# EAGLE design usbtinyisp (EAGLE 7.7.0)
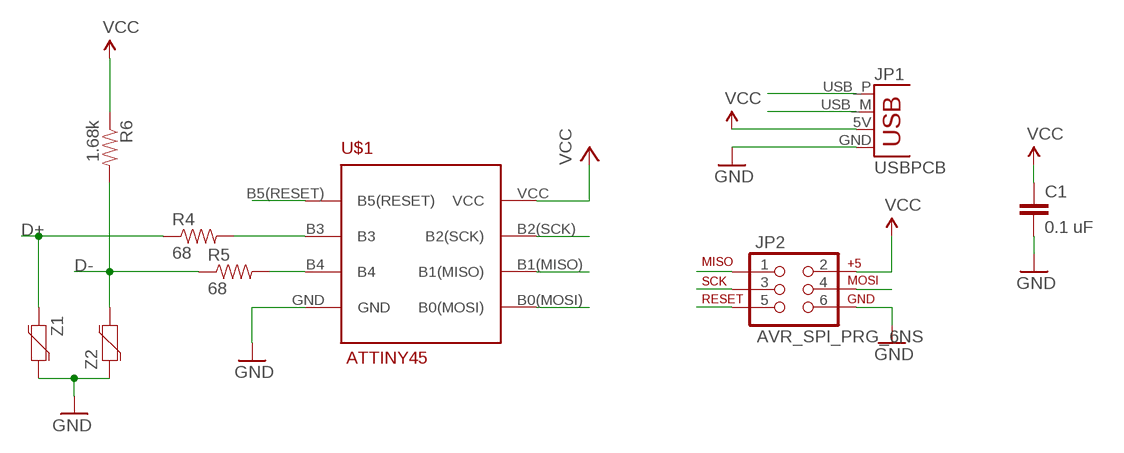
[diagram p0: schematic, sheet 1]

## Parts
C1  0.1 uF  CAP0603-CAP  [0603-CAP]
JP1  USBPCB  [USB-A-PCB]
JP2  AVR_SPI_PRG_6NS  [2X3-NS]
R4  68  RESISTOR0603-RES  [0603-RES]
R5  68  RESISTOR0603-RES  [0603-RES]
R6  1.68k  RESISTOR0603-RES  [0603-RES]
U$1  ATTINY45  [ATTINY45]
Z1  VARISTOR-0603  [0603-RES]
Z2  VARISTOR-0603  [0603-RES]

## Nets
D+: JP1.USB_P(D+) R4.1 Z1.1
D-: JP1.USB_M(D-) R5.1 R6.2 Z2.2
GND: C1.2 JP1.GND JP2.6 U$1.GND Z1.2 Z2.1
MISO: JP2.1 U$1.B1(MISO)
MOSI: JP2.4 U$1.B0(MOSI)
N$3: R4.2 U$1.B3
N$4: R5.2 U$1.B4
RST: JP2.5 U$1.B5(RESET)
SCK: JP2.3 U$1.B2(SCK)
VCC: C1.1 JP1.5V(VBUS) JP2.2 R6.1 U$1.VCC

## Library data of the parts
C1 = SparkFun-Capacitors:CAP: Capacitor Standard 0603 ceramic capacitor, and 0.1" leaded capacitor.
JP1 = SparkFun-Connectors:USB: USB Connectors USB-B-PTH is fully proven SKU : PRT-00139/CONN-08278 USB-miniB is fully proven SKU : PRT-00587 USB-A-PCB is untested. USB-A-H is throughly reviewed, but untested. Spark Fun Electronics SKU : PRT-00437 USB-B-SMT is throughly reviewed, but untested. Needs silkscreen touching up. USB-A-S has not been used/tested USB-MB-H has not been used/tested USB-MICROB has been used. CONN-09505
JP2 = SparkFun-Connectors:AVR_SPI_PRG_6: AVR ISP 6 Pin This is the reduced ISP connector for AVR programming. Common on Arduino. This footprint will take up less PCB space and can be used with a 10-pin to 6-pin adapter such as SKU: BOB-08508 **Special note about "TEST_POINT" package. The stop mask is on the top side, so if you want your programming test points to be on the bottom of your board, make sure to place this package on the bottom side of the board. This also ensure that the orientation to program from the bottom side will be correct.
R4-R6 = SparkFun-Passives:RESISTOR: Resistor Basic schematic elements and footprints for 0603, 1206, and PTH resistors.
U$1 = AVR_attinys:ATTINY45: http://www.atmel.com/images/atmel-2586-avr-8-bit-microcontroller-attiny25-attiny45-attiny85_datasheet.pdf
Z1 Z2 = SparkFun-DiscreteSemi:VARISTOR: Varistor Varistor (Variable resistor) is a nonlinear resistive element of the voltage dependence that resistance changes with applied voltage. Varistor is equivalent with Zener diode of two series connection.

## Board
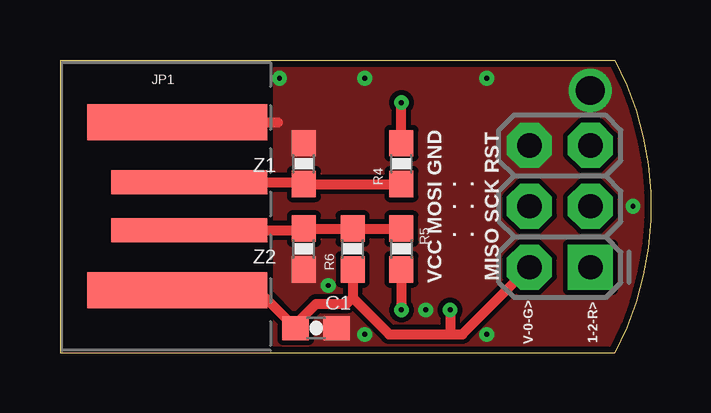
[diagram p1: board, top side]
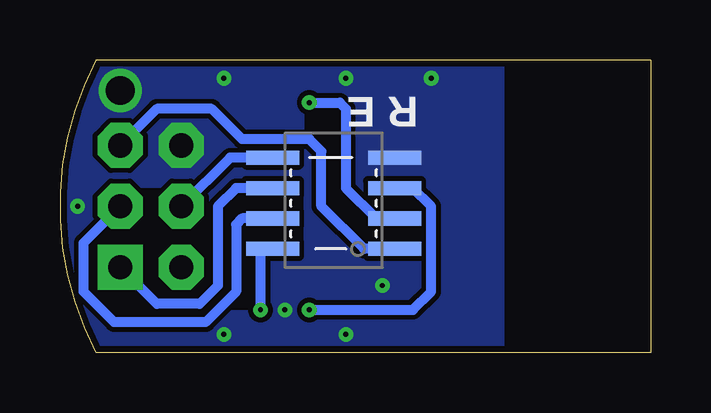
[diagram p2: board, bottom side, seen from below]

Size 24.61 x 12.19 mm. Coordinates in mm from the lower left corner, seen from the top.
Outline: 0,12.19 0,0 23.11,0 arc56 23.11,12.19 0,12.19
Copper layers (1*16): Top 0.035mm / dielectric 1.5mm / Bottom 0.035mm
Design rules "default *": minimum track width 10mil, minimum drill 8mil, track to track 8mil, track to pad 8mil, pad to pad 8mil, via to via 8mil, smd to smd 8mil, copper to edge 10mil, drill to drill 8mil, minimum pad ring 10mil, minimum via ring 8mil, stop-mask expansion 4mil, vias tented up to drill 25mil, thermal gap 10mil
bRestrict: area 18.5,3.3 to 22.6,6.9; area 9.7,4.8 to 14.2,10.2; area 14.5,5.6 to 17.8,6.6; area 14.5,4.6 to 17,5.3; area 16.5,1.8 to 17.8,4.1

### Footprints (pad centres in the part's own frame; a part is rotated, then mirrored left to right if it is on the bottom)
0603-CAP = smd 1.1 x 1: 1 -0.85,0; 2 0.85,0
USB-A-PCB = smd 7.5 x 1.5: 5V -0.2,-3.5; GND -0.2,3.5 | smd 6.5 x 1: USB_M 0.3,-1; USB_P 0.3,1
2X3-NS = drill 1.016 pad 1.88 square: 1 -2.54,-1.27 | drill 1.016 pad 1.88 octagon: 2 -2.54,1.27; 3 0,-1.27; 4 0,1.27; 5 2.54,-1.27; 6 2.54,1.27
0603-RES = smd 1.1 x 1: 1 -0.85,0; 2 0.85,0
ATTINY45 = smd 2.21 x 0.584: B0(MOSI) 2.54,-2.032; B1(MISO) 2.54,-0.762; B2(SCK) 2.54,0.508; B3 -2.54,0.508; B4 -2.54,-0.762; B5(RESET) -2.54,1.778; GND -2.54,-2.032; VCC 2.54,1.778

### Placement (x,y rotation side)
C1  10.67,1.02 0 top
JP1  5.08,6.1 0 top
JP2  20.83,6.1 90 top
R4  14.22,7.87 90 top
R5  14.22,4.32 270 top
R6  12.19,4.32 90 top
U$1  13.21,6.1 180 bottom
Z1  10.16,7.87 90 top
Z2  10.16,4.32 90 top

### Tracks (layer width: path | path; a pad name or v marks a point on that pad's centre or on a via)
D+
  Top 0.406: JP1.USB_P 10.16,7.1 Z1.1 R4.1
D-
  Top 0.406: JP1.USB_M 10.16,5.1 Z2.2 R6.2 R5.1
GND  (via drill 0.2, 0.2 pad 0.46, 1.2)
  Top 0.406: JP1.GND 9.09,9.6
  other vias: 17.78,11.43 11.18,2.79 12.7,0.76 15.24,1.78 22.1,10.92 17.78,0.76 23.88,6.1 12.7,11.43 9.14,11.43
  pour Top (no thermals): 8.89,13.72 8.89,-0.51 34.8,-0.25 34.8,13.72
  pour Bottom (no thermals): 6.1,15.24 6.1,-2.54 36.32,-2.79 36.32,15.49
MISO
  Bottom 0.406: U$1.B1(MISO) 17.27,6.86 18.03,6.1 18.03,2.79 18.8,2.03 20.57,2.03 JP2.1
MOSI
  Bottom 0.406: U$1.B0(MOSI) 17.53,8.13 JP2.4
N$3  (via drill 0.2 pad 0.46)
  Top 0.406: R4.2 v14.22,10.41
  Bottom 0.406: v14.22,10.41 12.95,10.41 12.7,10.16 12.7,6.86 11.43,5.59 U$1.B3
N$4  (via drill 0.2 pad 0.46)
  Top 0.406: R5.2 v14.22,1.78
  Bottom 0.406: v14.22,1.78 9.91,1.78 9.14,2.54 9.14,6.1 9.91,6.86 U$1.B4
RST
  Bottom 0.406: U$1.B5(RESET) 11.94,4.32 13.72,6.1 13.72,8.38 14.22,8.89 17.02,8.89 18.29,10.16 20.57,10.16 JP2.5
SCK
  Bottom 0.406: U$1.B2(SCK) 17.02,5.59 17.27,5.33 17.27,2.54 18.54,1.27 22.35,1.27 23.62,2.54 23.62,4.57 JP2.3
VCC  (via drill 0.2 pad 0.46)
  Top 0.406: JP1.5V 8.24,2.6 C1.1 9.82,1.18 10.67,2.03 11.94,2.03 12.19,2.29 | R6.1 12.19,2.29 | 12.19,2.29 13.72,0.76 16.26,0.76 | 16.26,0.76 16.76,0.76 JP2.2 | v16.26,1.78 16.26,0.76
  Bottom 0.406: v16.26,1.78 16.26,4.32 U$1.VCC

### Text on the board
tPlace: VCC MOSI GND / . . . | . . . / MISO SCK RST | V-0-G> / / 1-2-R>
bPlace: R E
bStop: H